# Altium schematic sheet Pulse.SchDoc
size A3
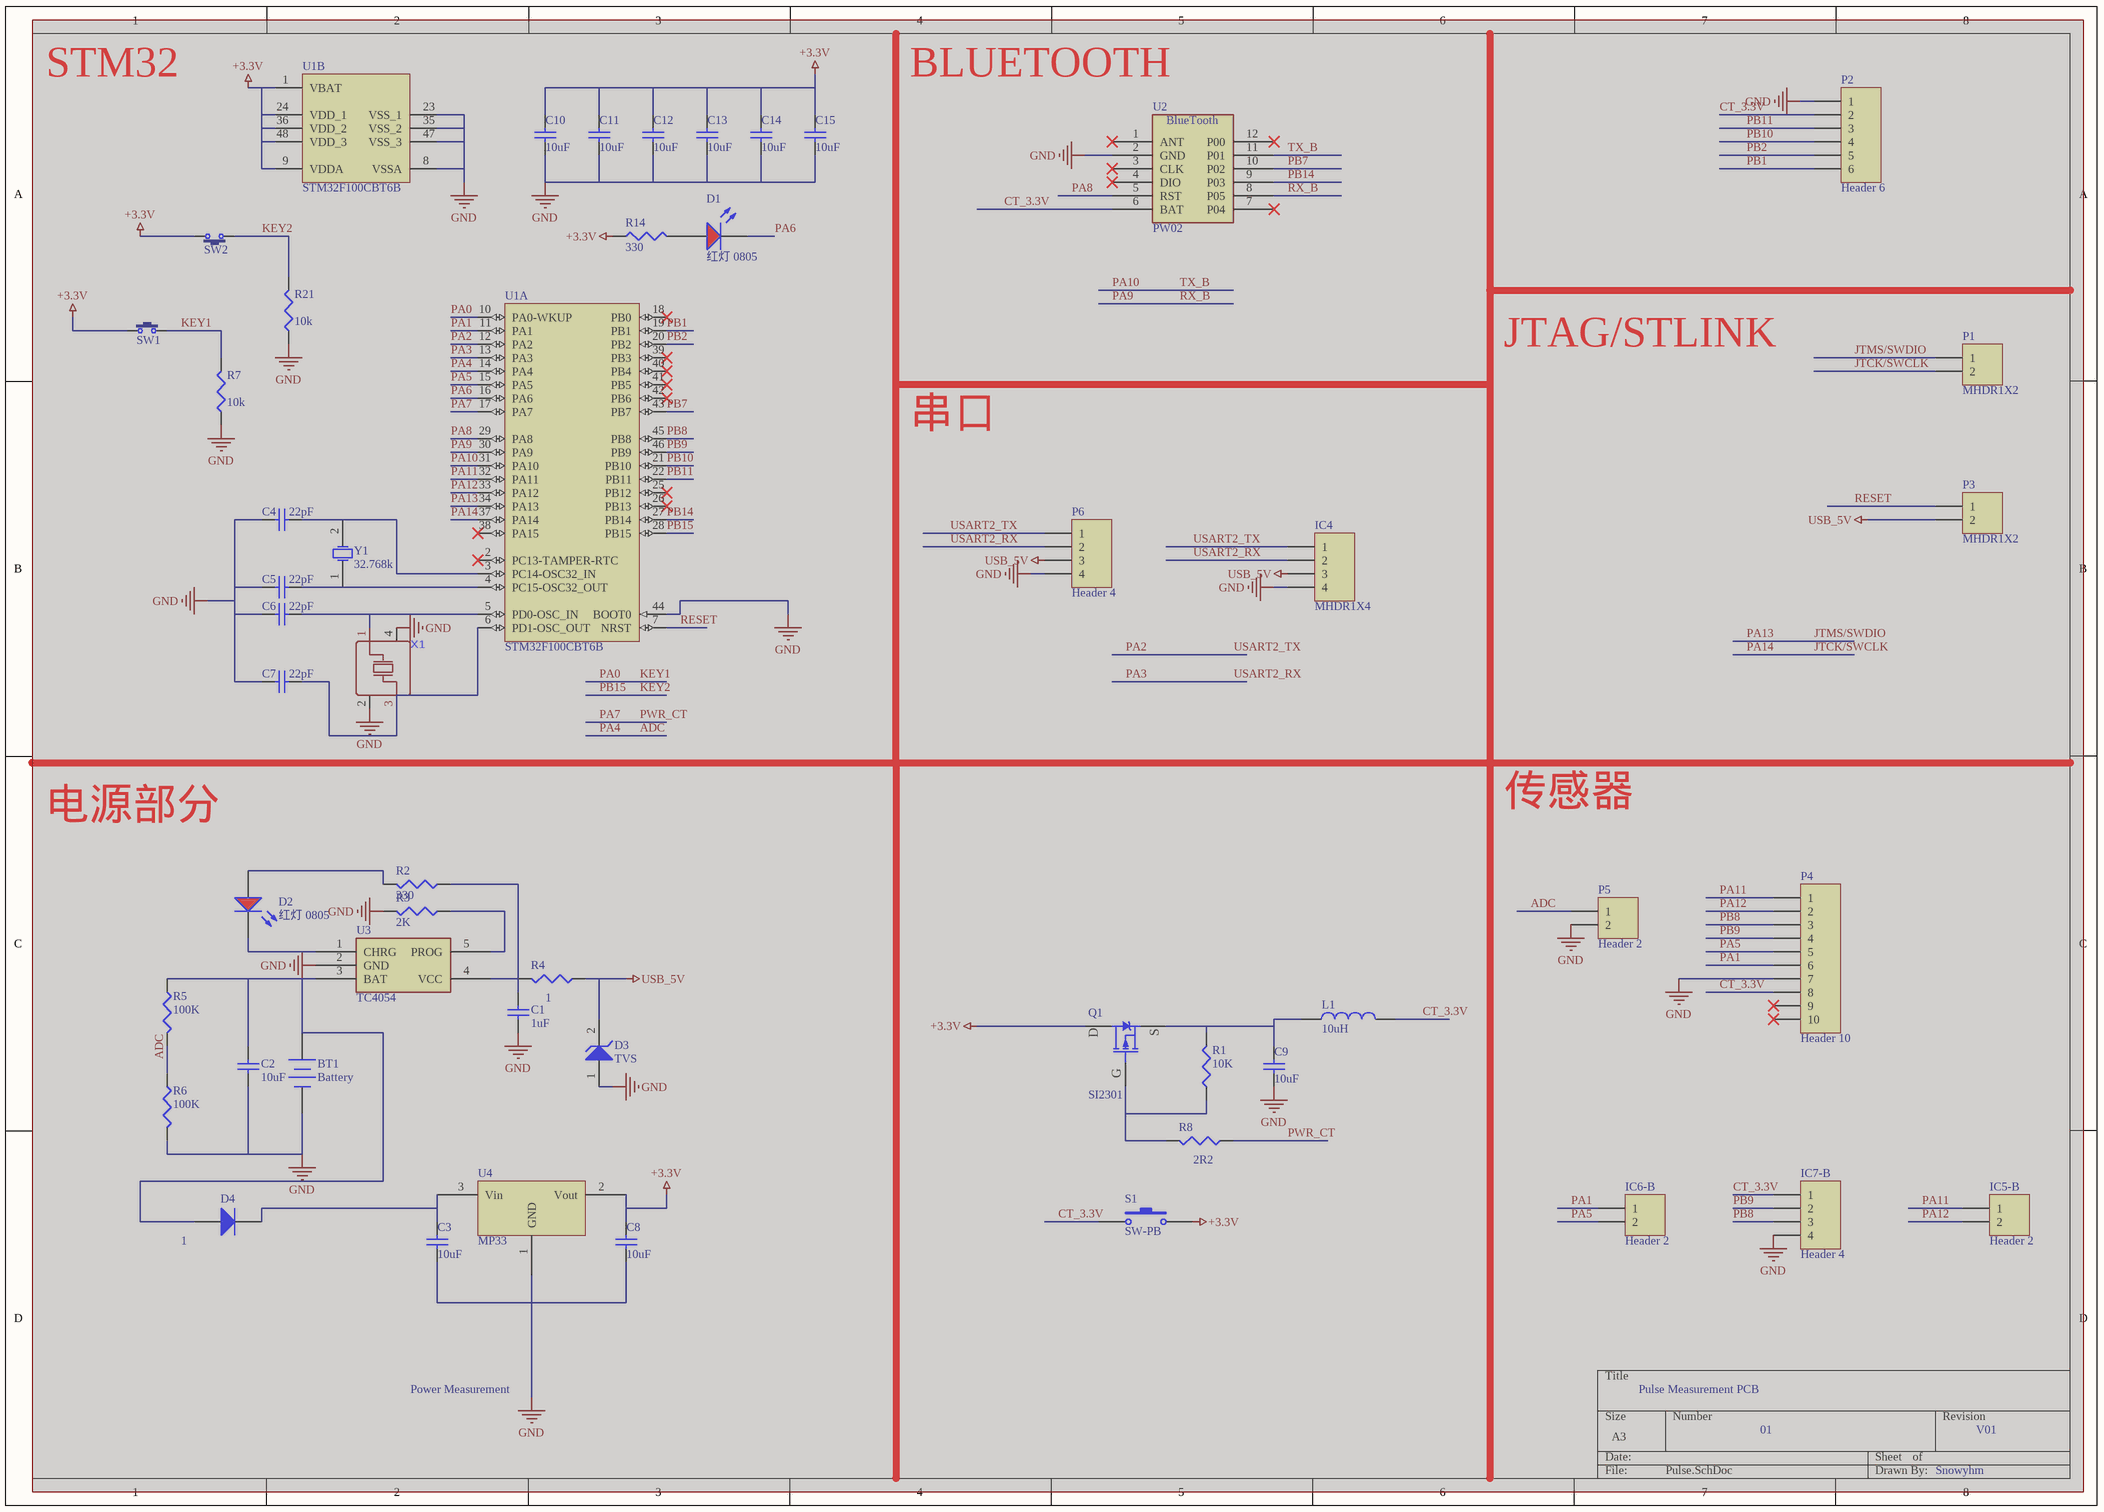
[diagram p0: Pulse.SchDoc]

## Parts
BT1  Battery  [BAT-2]  (masked out: inside a compile mask, not in the netlist)
C1  value 1uF  [LC-0603_C]  (hidden comment: Cap Semi)  (masked out: inside a compile mask, not in the netlist)
C2  value 10uF  [LC-0603_C]  (hidden comment: Cap Semi)  (masked out: inside a compile mask, not in the netlist)
C3  value 10uF  [LC-0603_C]  (hidden comment: Cap Semi)  (masked out: inside a compile mask, not in the netlist)
C4  value 22pF  [LC-0603_C]  (hidden comment: Cap Semi)  (masked out: inside a compile mask, not in the netlist)
C5  value 22pF  [LC-0603_C]  (hidden comment: Cap Semi)  (masked out: inside a compile mask, not in the netlist)
C6  value 22pF  [LC-0603_C]  (hidden comment: Cap Semi)  (masked out: inside a compile mask, not in the netlist)
C7  value 22pF  [LC-0603_C]  (hidden comment: Cap Semi)  (masked out: inside a compile mask, not in the netlist)
C8  value 10uF  [LC-0603_C]  (hidden comment: Cap Semi)  (masked out: inside a compile mask, not in the netlist)
C9  value 10uF  [LC-0603_C]  (hidden comment: Cap Semi)  (masked out: inside a compile mask, not in the netlist)
C10  value 10uF  [LC-0603_C]  (hidden comment: Cap Semi)  (masked out: inside a compile mask, not in the netlist)
C11  value 10uF  [LC-0603_C]  (hidden comment: Cap Semi)  (masked out: inside a compile mask, not in the netlist)
C12  value 10uF  [LC-0603_C]  (hidden comment: Cap Semi)  (masked out: inside a compile mask, not in the netlist)
C13  value 10uF  [LC-0603_C]  (hidden comment: Cap Semi)  (masked out: inside a compile mask, not in the netlist)
C14  value 10uF  [LC-0603_C]  (hidden comment: Cap Semi)  (masked out: inside a compile mask, not in the netlist)
C15  value 10uF  [LC-0603_C]  (hidden comment: Cap Semi)  (masked out: inside a compile mask, not in the netlist)
D1  红灯 0805  [LC-0805_LED_S1]  (masked out: inside a compile mask, not in the netlist)
D2  红灯 0805  [LC-0805_LED_S1]  (masked out: inside a compile mask, not in the netlist)
D3  TVS  [LC-SOD-123]  (masked out: inside a compile mask, not in the netlist)
D4  1  [LC-SOD-123]  (masked out: inside a compile mask, not in the netlist)
IC4  MHDR1X4  [MHDR1X4]  (masked out: inside a compile mask, not in the netlist)
IC5-B  Header 2  [HDR1X2]  (masked out: inside a compile mask, not in the netlist)
IC6-B  Header 2  [HDR1X2]  (masked out: inside a compile mask, not in the netlist)
IC7-B  Header 4  [HDR1X4]  (masked out: inside a compile mask, not in the netlist)
L1  10uH  [L 0805]  (masked out: inside a compile mask, not in the netlist)
P1  MHDR1X2  [MHDR1X2]  (masked out: inside a compile mask, not in the netlist)
P2  Header 6  [HDR1X6]  (masked out: inside a compile mask, not in the netlist)
P3  MHDR1X2  [MHDR1X2]  (masked out: inside a compile mask, not in the netlist)
P4  Header 10  [8P]  (masked out: inside a compile mask, not in the netlist)
P5  Header 2  [HDR1X2]  (masked out: inside a compile mask, not in the netlist)
P6  Header 4  [fpc_4p]  (masked out: inside a compile mask, not in the netlist)
Q1  SI2301  [SOT23-3N]  (masked out: inside a compile mask, not in the netlist)
R1  value 10K  [LC-0603_R]  (hidden comment: Res3)  (masked out: inside a compile mask, not in the netlist)
R2  value 330  [LC-0603_R]  (hidden comment: Res3)  (masked out: inside a compile mask, not in the netlist)
R3  value 2K  [LC-0603_R]  (hidden comment: Res3)  (masked out: inside a compile mask, not in the netlist)
R4  value 1  [LC-0603_R]  (hidden comment: Res3)  (masked out: inside a compile mask, not in the netlist)
R5  value 100K  [LC-0603_R]  (hidden comment: Res3)  (masked out: inside a compile mask, not in the netlist)
R6  value 100K  [LC-0603_R]  (hidden comment: Res3)  (masked out: inside a compile mask, not in the netlist)
R7  value 10k  [LC-0603_R]  (hidden comment: Res3)  (masked out: inside a compile mask, not in the netlist)
R8  value 2R2  [LC-0603_R]  (hidden comment: Res3)  (masked out: inside a compile mask, not in the netlist)
R14  value 330  [LC-0603_R]  (hidden comment: Res3)  (masked out: inside a compile mask, not in the netlist)
R21  value 10k  [LC-0603_R]  (hidden comment: Res3)  (masked out: inside a compile mask, not in the netlist)
S1  SW-PB  [SW-SMD_DSHP01TSGET]  (masked out: inside a compile mask, not in the netlist)
SW1  3x6x5  [button]  (value not drawn)  (masked out: inside a compile mask, not in the netlist)
SW2  3x6x5  [button]  (value not drawn)  (masked out: inside a compile mask, not in the netlist)
U1  STM32F100CBT6B  [STM-LQFP48_L]  (parts A,B of 2)  (masked out: inside a compile mask, not in the netlist)
U2  PW02  [bluetooth]  (masked out: inside a compile mask, not in the netlist)
U3  TC4054  [SOT23-5]  (masked out: inside a compile mask, not in the netlist)
U4  MP33  [LC-SOT-23(SOT-23-3)]  (masked out: inside a compile mask, not in the netlist)
X1  (no value)  [OSC 3225-4P]  (masked out: inside a compile mask, not in the netlist)
Y1  32.768k  [OSC 3215-2P]  (masked out: inside a compile mask, not in the netlist)

## Notes on the sheet
- STM32
- BLUETOOTH
- JTAG/STLINK
- 串口
- 电源部分
- 传感器
- Power Measurement
- Pulse Measurement PCB
- 01
- V01
- Snowyhm

## Library data of the parts
BT1 = Battery: Multicell Battery; Published: 24-Mar-1999; LatestRevisionDate: 17-Jul-2002; LatestRevisionNote: Re-released for DXP Platform.; PackageReference: BAT-2; Publisher: Altium Limited; PackageDescription: Battery; 2 Leads
C1-C15 = Cap Semi: Capacitor (Semiconductor SIM Model); Published: 8-Jun-2000; LatestRevisionDate: 29-May-2009; LatestRevisionNote: IPC-7351 Footprint Added.; PackageReference: C1206; Publisher: Altium Limited; PackageDescription: Chip Capacitor
D1 D2 = 0805 红灯: 发光二极管; ComponentLink1Description: 供应商链接; ComponentLink1URL: http://www.szlcsc.com/product/details_2668.html; Package: 0805; Supplier: LC; SuppliersPartNumber: C2295
D3 = D Zener: Zener Diode; Published: 8-Jun-2000; LatestRevisionDate: 17-Jul-2002; LatestRevisionNote: Re-released for DXP Platform.; PackageReference: DIODE-0.7; Publisher: Altium Limited; PackageDescription: Diode, Thru-Hole; 2 Leads; 0.7 in Pin Spacing
D4 = SOD-323 1N4148WS T4: 二极管; ComponentLink1Description: 供应商链接; ComponentLink1URL: http://www.szlcsc.com/product/details_2485.html; Package: SOD-323; Supplier: LC; SuppliersPartNumber: C2128
IC4 = MHDR1X4: Header, 4-Pin; LatestRevisionDate: 17-Jul-2002; LatestRevisionNote: Re-released for DXP Platform.; Publisher: Altium Limited
IC5-B IC6-B P5 = Header 2: Header, 2-Pin; LatestRevisionDate: 17-Jul-2002; LatestRevisionNote: Re-released for DXP Platform.; Publisher: Altium Limited
IC7-B P6 = Header 4: Header, 4-Pin; LatestRevisionDate: 17-Jul-2002; LatestRevisionNote: Re-released for DXP Platform.; Publisher: Altium Limited
L1 = L: 小功率贴片电感; 淘宝ID: 封装库来自淘宝 ID：黄晶宝石; BOM名称: 小功率贴片电感; 联系售后: https://shop463601444.taobao.com
P1 P3 = MHDR1X2: Header, 2-Pin; LatestRevisionDate: 17-Jul-2002; LatestRevisionNote: Re-released for DXP Platform.; Publisher: Altium Limited
P2 = Header 6: Header, 6-Pin; LatestRevisionDate: 17-Jul-2002; LatestRevisionNote: Re-released for DXP Platform.; Publisher: Altium Limited
P4 = Header 10: Header, 10-Pin; LatestRevisionDate: 17-Jul-2002; LatestRevisionNote: Re-released for DXP Platform.; Publisher: Altium Limited
Q1 = SI2301: P沟道场效应管; BOM名称: P沟道场效应管; 学习资源: https://shop463601444.taobao.com
R1-R8 R14 R21 = Res3: Resistor; Published: 8-Jun-2000; LatestRevisionDate: 29-May-2009; LatestRevisionNote: IPC-7351 Footprint Added.; PackageReference: J1-0603; Publisher: Altium Limited; PackageDescription: Chip Resistor
S1 = SW-PB: Switch; Published: 24-Mar-1999; LatestRevisionDate: 17-Jul-2002; LatestRevisionNote: Re-released for DXP Platform.; PackageReference: SPST-2; Publisher: Altium Limited; PackageDescription: Switch; 2 Leads
SW1 SW2 = TSW 3x6: 3x6轻触开关; 免费技术支持，联系售后: 唯一出售店铺网址https://shop463601444.taobao.com; 封装库来自淘宝卖家 ID：黄晶宝石: 其他店铺购入均为盗版假冒封装库，请立即申请退款，本店3~10元现金奖励; BOM名称: 3x6轻触开关
U1 = STM32F100CBT6B: ARM Cortex-M3 32-bit MCU, 128 KB Flash, 8 KB Internal RAM, 37 I/Os, 48-pin LQFP, -40 to 85 degC, Tray; A/D Converter: 1x12-bit (10 Channel); D/A Converter: 2x12-bit (2 Channel); FLASH Size (Prog) (kB): 128; I/Os (High Current): 37; Internal RAM Size (kB): 8; Operating Frequency(F) (Processor speed) (MHz): 24; Supply Voltage(Vcc) min (V): 2; DatasheetVersion: Rev. 7; PackageVersion: Rev. 6, 06/2013; PackageReference: LQFP48; PackageDescription: 48-Pin Low Profile Quad Flat Package, 7 x 7 mm Body, 0.5 mm Pitch; Supplier 1: Digi-Key; Supplier Part Number 1: 497-10498-ND; Supplier 2: Farnell; Supplier Part Number 2: 1838512; Supplier 3: Newark; Supplier Part Number 3: 86R1308; Supplier 4: Newark; Supplier Part Number 4: 76R0985; Supplier 5: Mouser; Supplier Part Number 5: 511-STM32F100CBT6B; Core: ARM Cortex-M3; Packing: Tray; Mounting Technology: Surface Mount; PartNumber: STM32F100CBT6B; ComponentLink1Description: Manufacturer URL; ComponentLink1URL: http://www.st.com/web/en/home.html; ComponentLink2Description: Datasheet; ComponentLink2URL: http://www.st.com/st-web-ui/static/active/en/resource/technical/document/datasheet/CD00251732.pdf; ComponentLink3Description: Package Specification; ComponentLink3URL: http://www.st.com/st-web-ui/static/active/en/resource/technical/document/datasheet/DM00058181.pdf
U2 = PW02: BlueTooth
U4 = AMS1117: 三端稳压芯片
X1 = SMD-3225_4P12M12PF10PPM
Y1 = XTAL: Crystal Oscillator; Published: 8-Jun-2000; LatestRevisionDate: 17-Jul-2002; LatestRevisionNote: Re-released for DXP Platform.; PackageReference: R38; Publisher: Altium Limited; PackageDescription: Crystal, Thru-Hole; 2 Leads; Body 3.1 x 8.2 mm (Dia.xH)